# EAGLE design LED-Rectifier-v003 (EAGLE 7.6.0)
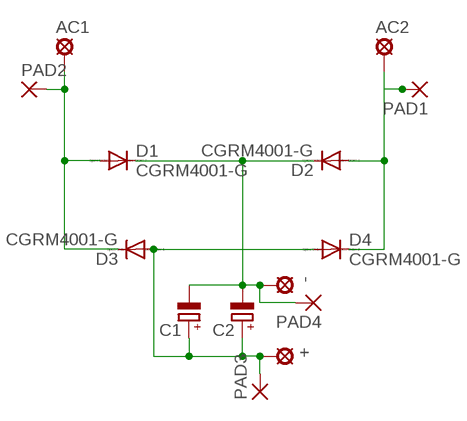
[diagram p0: schematic, sheet 1]

## Parts
+  SE14  [SE14]
-  SE14  [SE14]
AC1  SE14  [SE14]
AC2  SE14  [SE14]
C1  CPOL-EU085CS-1AW  [085CS_1AW]
C2  CPOL-EUE3.5-10  [E3,5-10]
D1  CGRM4001-G  [SOD-123_MINI-SMA]
D2  CGRM4001-G  [SOD-123_MINI-SMA]
D3  CGRM4001-G  [SOD-123_MINI-SMA]
D4  CGRM4001-G  [SOD-123_MINI-SMA]
PAD1  SMD5  [SMD2,54-5,08]
PAD2  SMD5  [SMD2,54-5,08]
PAD3  SMD5  [SMD2,54-5,08]
PAD4  SMD5  [SMD2,54-5,08]

## Nets
+: +.MP C1.+ C2.+ D3.A D4.A PAD3.1(P)
-: -.MP C1.- C2.- D1.C D2.C PAD4.1(P)
AC1: AC1.MP D1.A D3.C PAD2.1(P)
AC2: AC2.MP D2.A D4.C PAD1.1(P)

## Library data of the parts
+ - AC1 AC2 = solpad:SE14: SOLDER PAD E1553, drill 1,4mm, distributor Buerklin, 07F820
C1 C2 = rcl:CPOL-EU: POLARIZED CAPACITOR, European symbol
D1-D4 = diode:CGRM400*-G: Molded plasitc,JEDEC SOD-123/Mini SMA Source: Comchip CGRM4001-G.pdf
PAD1-PAD4 = wirepad:SMD5: SMD PAD

## Net classes
0 default: width 1.778 mm

## Board
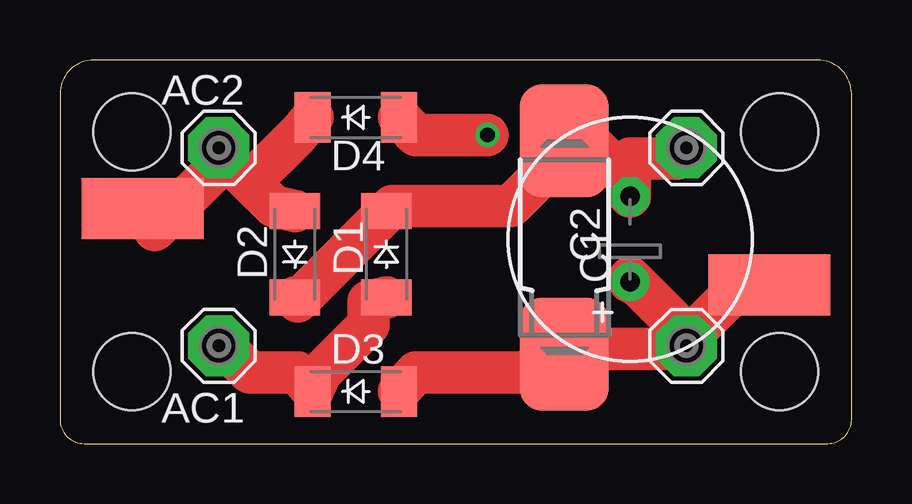
[diagram p1: board, top side]
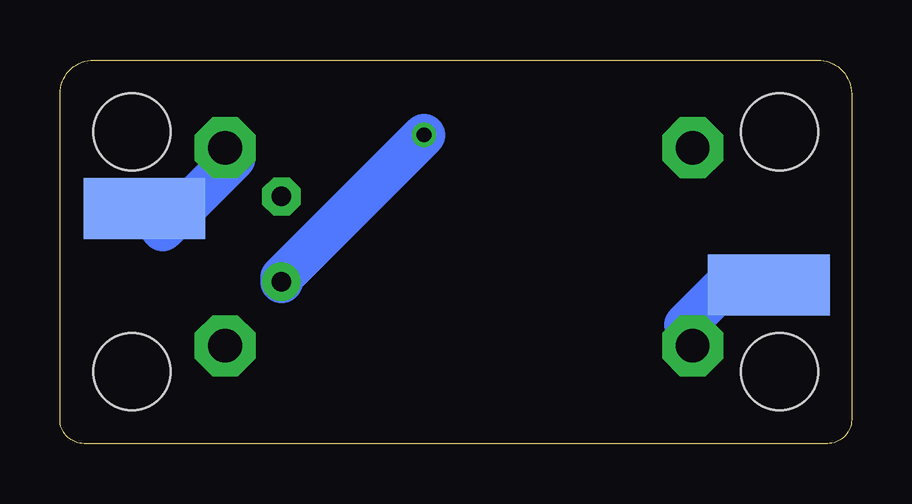
[diagram p2: board, bottom side, seen from below]

Size 33 x 16 mm. Coordinates in mm from the lower left corner, seen from the top.
Outline: 0,14.59 0,1 arc90 1,0 32,0 arc90 33,1 33,14.59 arc90 31.59,16 1.41,16 arc90 0,14.59
Copper layers (1*16): Top 0.035mm / dielectric 1.5mm / Bottom 0.035mm
Design rules "default": minimum track width 10mil, minimum drill 24mil, track to track 8mil, track to pad 8mil, pad to pad 8mil, via to via 8mil, smd to smd 8mil, copper to edge 40mil, drill to drill 8mil, minimum pad ring 10mil, minimum via ring 8mil, stop-mask expansion 4mil, vias tented up to drill 0mil, thermal gap 10mil
Holes 3.2 mm at 3,13 3,3 30,13 30,3

### Footprints (pad centres in the part's own frame; a part is rotated, then mirrored left to right if it is on the bottom)
SE14 = drill 1.397 pad 2.54 octagon: MP 0,0
085CS_1AW = smd 4.7 x 3.7: + 4.45,0; - -4.45,0
E3,5-10 = drill 0.813 pad 1.6: + -1.778,0 | drill 0.813 pad 1.6 octagon: - 1.778,0
SOD-123_MINI-SMA = smd 1.5 x 2.1: A 1.8,0; C -1.8,0
SMD2,54-5,08 = smd 2.54 x 5.08: 1 0,0

### Placement (x,y rotation side)
+  26.11,4.08 0 top
-  26.11,12.34 0 top
AC1  6.62,4.08 0 top
AC2  6.62,12.34 0 top
C1  21.03,8.18 270 top
C2  23.77,8.53 90 top
D1  13.61,7.89 270 top
D2  9.79,7.89 90 top
D3  12.34,2.17 0 top
D4  12.34,13.61 0 top
PAD1  3.45,9.79 90 top
PAD2  3.45,6.62 90 bottom
PAD3  29.57,6.62 90 top
PAD4  29.48,9.79 90 bottom

### Tracks (layer width: path | path; a pad name or v marks a point on that pad's centre or on a via)
+  (via drill 0.61)
  Top 1.778: v17.82,12.87 14.85,12.87 D4.A | D3.A 14.85,2.96 20.79,2.96 C1.+ 21.78,3.95 25.75,3.95 +.MP | +.MP 26.74,4.94 28.72,6.92 PAD3.1 | C2.+ 23.77,6.92 25.75,4.94 +.MP
  Bottom 1.778: v17.82,12.87 23.77,6.92 C2.+
-
  Top 1.778: 13.86,9.9 9.9,5.93 D2.C | 13.86,9.9 D1.C 13.86,9.9 | 23.27,11.38 21.78,12.87 C1.- 20.79,11.88 18.81,9.9 13.86,9.9 | 23.27,11.38 23.77,10.89 C2.- | -.MP 25.75,11.88 23.77,11.88 23.27,11.38
  Bottom 1.778: PAD4.1 28.72,8.91 25.75,11.88 -.MP
AC1
  Top 1.778: AC1.MP 6.92,3.95 7.91,2.96 9.9,2.96 D3.C 10.89,2.96 12.87,4.94 12.87,5.93 D1.A
  Bottom 1.778: PAD2.1 3.95,6.92 4.94,6.92 6.92,4.94 AC1.MP
AC2
  Top 1.778: 6.92,11.88 7.91,10.89 | 7.91,10.89 8.91,9.9 D2.A | 6.92,11.88 AC2.MP 6.92,11.88 | 7.91,10.89 9.9,12.87 D4.C | 6.92,11.88 3.95,8.91 PAD1.1

### Text on the board
tValues: - | +
bValues: - | +